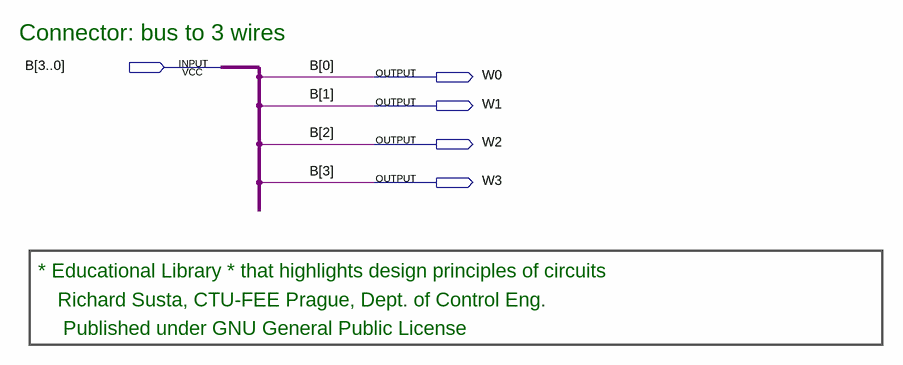
[diagram p0: schematic sheet]
// Quartus schematic split4bus.bdf as structural Verilog: 0 symbols, 5 pins
module split4bus (
  input  [3:0] B,
  output W0,
  output W1,
  output W2,
  output W3
);


  assign W0 = B[0];
  assign W1 = B[1];
  assign W2 = B[2];
  assign W3 = B[3];

  // Notes on the sheet:
  //   Connector: bus to 3 wires
  //   * Educational Library * that highlights design principles of circuits
  //   Richard Susta, CTU-FEE Prague, Dept. of Control Eng. 
  //    Published under GNU General Public License
endmodule
